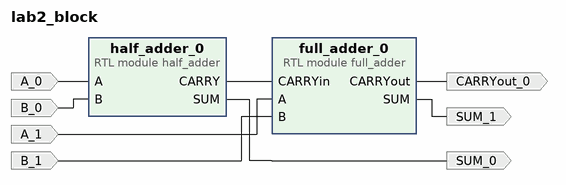
[diagram p0: block diagram of the top level]
# Vivado block design lab2_block, xc7a100tcsg324-1, Vivado 2019.1.2
create_bd_design lab2_block

create_bd_port -dir I A_0
create_bd_port -dir I B_0
create_bd_port -dir I A_1
create_bd_port -dir I B_1
create_bd_port -dir O SUM_0
create_bd_port -dir O SUM_1
create_bd_port -dir O CARRYout_0

create_bd_cell -type module -reference half_adder half_adder_0
create_bd_cell -type module -reference full_adder full_adder_0

# ---- connections ----

connect_bd_net [get_bd_pins half_adder_0/CARRY] [get_bd_pins full_adder_0/CARRYin]
connect_bd_net -net A_0_1 [get_bd_ports A_0] [get_bd_pins half_adder_0/A]
connect_bd_net -net B_0_1 [get_bd_ports B_0] [get_bd_pins half_adder_0/B]
connect_bd_net -net A_1_1 [get_bd_ports A_1] [get_bd_pins full_adder_0/A]
connect_bd_net -net B_1_1 [get_bd_ports B_1] [get_bd_pins full_adder_0/B]
connect_bd_net [get_bd_pins half_adder_0/SUM] [get_bd_ports SUM_0]
connect_bd_net [get_bd_pins full_adder_0/SUM] [get_bd_ports SUM_1]
connect_bd_net [get_bd_pins full_adder_0/CARRYout] [get_bd_ports CARRYout_0]

validate_bd_design
save_bd_design
